# EAGLE design Rollo_APP_TS_V0.3 (EAGLE 6.4)
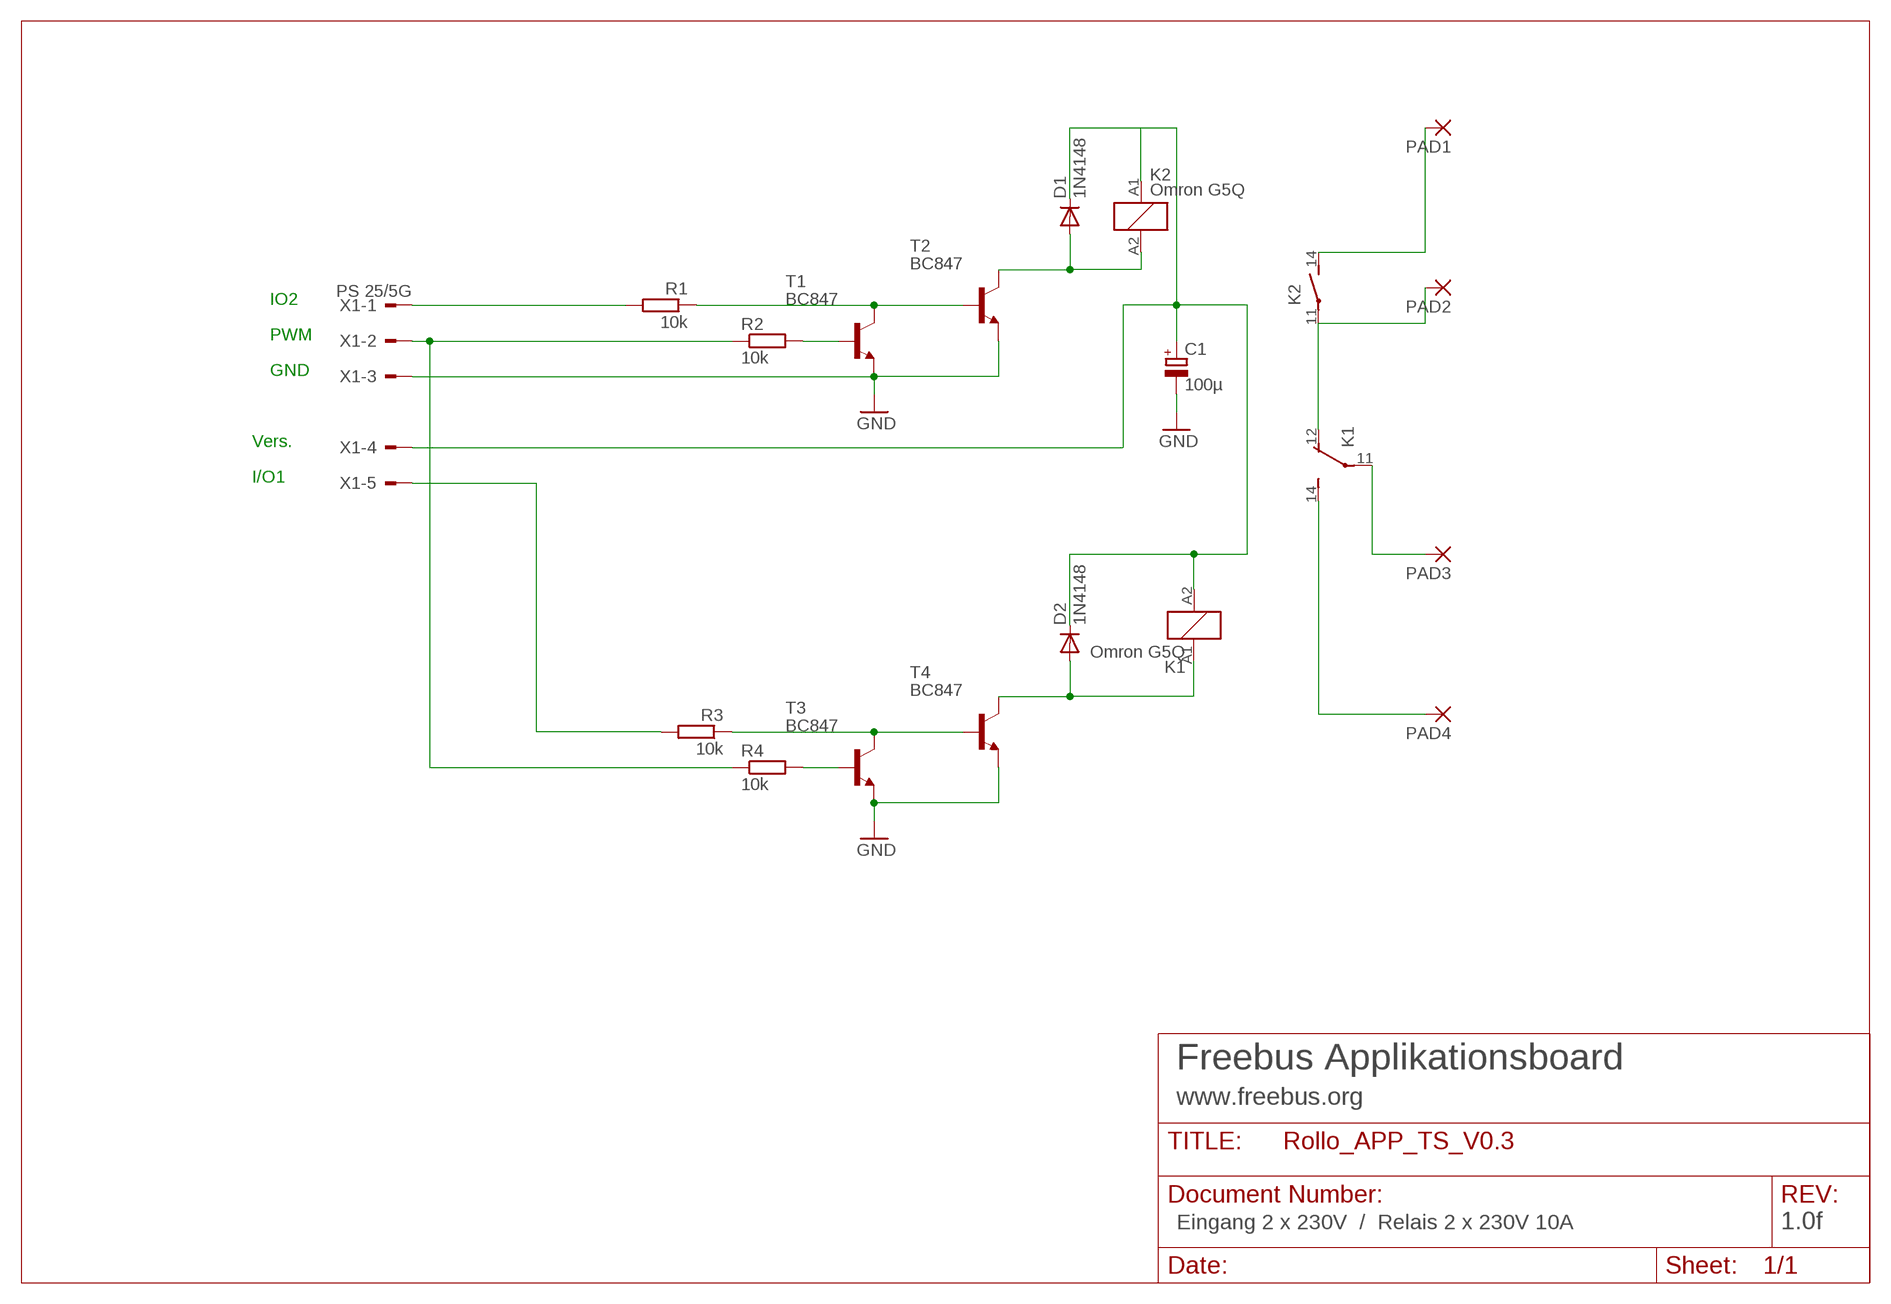
[diagram p0: schematic, sheet 1]

## Parts
C1  100µ  CPOL-EUE3.5-8  [E3,5-8]
D1  1N4148  DIODE-MINIMELF  [MINIMELF]
D2  1N4148  DIODE-MINIMELF  [MINIMELF]
K1  Omron G5Q  FREEBUS_RELAY_RE03U  [FREEBUS_RELAY_G5Q_1_EU]
K2  Omron G5Q  RE030024  [RE-SCHRACK]
PAD1  3,81/1,4  [3,81/1,4]
PAD2  3,81/1,4  [3,81/1,4]
PAD3  3,81/1,4  [3,81/1,4]
PAD4  3,81/1,4  [3,81/1,4]
R1  10k  R-EU_M1206  [M1206]
R2  10k  R-EU_M1206  [M1206]
R3  10k  R-EU_M1206  [M1206]
R4  10k  R-EU_M1206  [M1206]
T1  BC847  [SOT23]
T2  BC847  [SOT23]
T3  BC847  [SOT23]
T4  BC847  [SOT23]
X1  PS 25/5G  741256-49  [741256-49]

## Nets
GND: C1.- T1.2(E) T2.2(E) T3.2(E) T4.2(E) X1.3
N$1: K1.12(14:O) K2.11(2:P) PAD2.1(P)
N$2: R1.2 X1.1
N$3: K2.14(2:S) PAD1.1(P)
N$4: R3.2 X1.5
N$5: K1.14(14:S) PAD4.1(P)
N$6: K1.11(14:P) PAD3.1(P)
N$7: R2.1 R4.1 X1.2
N$8: R3.1 T3.3(C) T4.1(B)
N$9: R4.2 T3.1(B)
N$14: R1.1 T1.3(C) T2.1(B)
N$21: R2.2 T1.1(B)
R1: D2.A K1.A1 T4.3(C)
R3: D1.A K2.A2 T2.3(C)
VDD_IN1: C1.+ D1.C D2.C K1.A2 K2.A1 X1.4

## Notes on the sheet
- IO2
- PWM
- GND
- Vers.
- I/O1
- Freebus Applikationsboard
- www.freebus.org
- Eingang 2 x 230V  /  Relais 2 x 230V 10A | 1.0f

## Library data of the parts
C1 = rcl:CPOL-EU: POLARIZED CAPACITOR, European symbol
D1 D2 = diode:DIODE-: DIODE
K1 = hardware_application_relais8_4te_fb_relais_8_230V_83c:FREEBUS_RELAY_RE03U
K2 = relay:RE03*: Miniature PCB Relay 1 pole 6 A SCHRACK Source: http://www.schrack.com/.. 5812.pdf; MF: TYCO ELECTRONICS; MPN: RE030024; OC_FARNELL: 515851; OC_NEWARK: 52F910
PAD1-PAD4 = wirepad:3,81/1,4: THROUGH-HOLE PAD
R1-R4 = rcl:R-EU_: RESISTOR, European symbol
T1-T4 = transistor:BC847: NPN TRANSISTOR
X1 = con-conrad:741256-49: Connector with Kabel

## Board
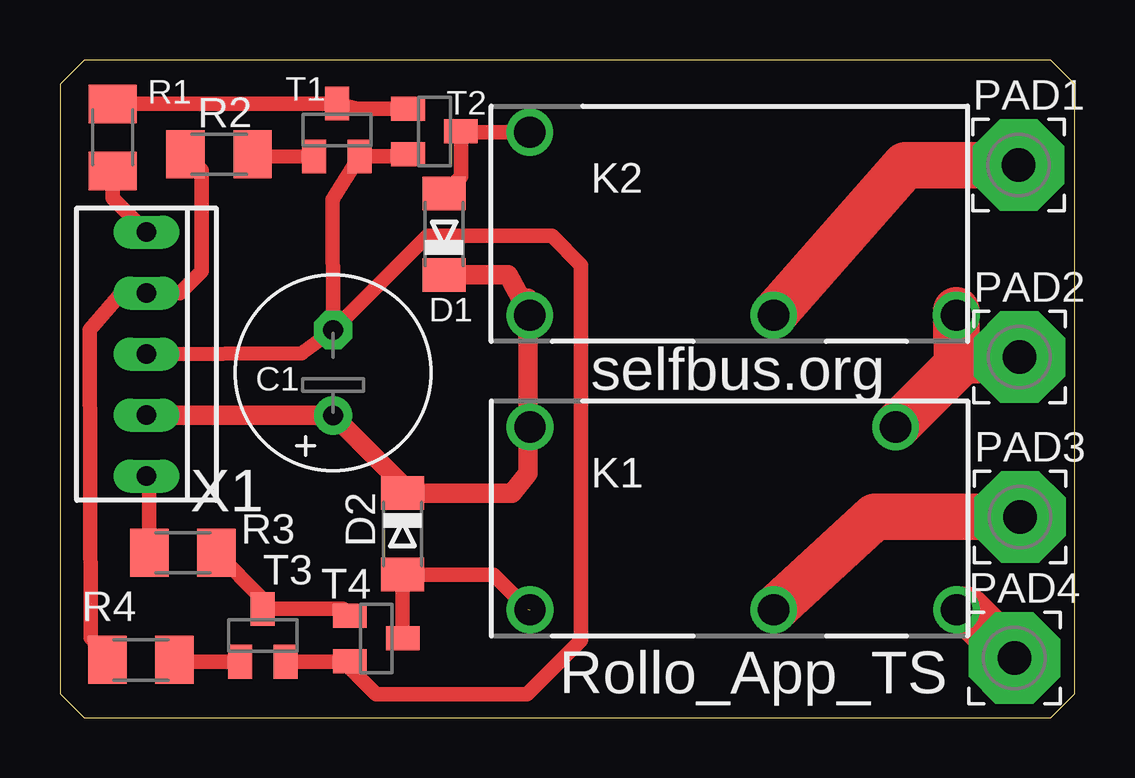
[diagram p1: board, top side]

Size 42.3 x 27.4 mm. Coordinates in mm from the lower left corner, seen from the top.
Outline: 1,0 41.3,0 42.3,1 42.3,26.4 41.3,27.4 1,27.4 0,26.4 0,1 1,0
Copper layers (1*16): Top 0.035mm / dielectric 1.5mm / Bottom 0.035mm
Design rules "default_freebus": minimum track width 10mil, minimum drill 24mil, track to track 8mil, track to pad 8mil, pad to pad 8mil, via to via 8mil, smd to smd 8mil, copper to edge 12mil, drill to drill 8mil, minimum pad ring 11mil, minimum via ring 8mil, stop-mask expansion 4mil, vias tented up to drill 0mil, thermal gap 10mil

### Footprints (pad centres in the part's own frame; a part is rotated, then mirrored left to right if it is on the bottom)
E3,5-8 = drill 0.813 pad 1.6: + -1.778,0 | drill 0.813 pad 1.6 octagon: - 1.778,0
MINIMELF = smd 1.4 x 1.8: A 1.7,0; C -1.7,0
FREEBUS_RELAY_G5Q_1_EU = drill 1.3: 11 1.27,-3.81; 12 6.35,3.81; 14 8.89,-3.81; A1 -8.89,-3.81; A2 -8.89,3.81
RE-SCHRACK = drill 1.3: 11 8.89,-3.81; 14 1.27,-3.81; A1 -8.89,-3.81; A2 -8.89,3.81
3,81/1,4 = drill 1.397 pad 3.81 octagon: 1 0,0
M1206 = smd 1.6 x 2: 1 -1.4,0; 2 1.4,0
SOT23 = smd 1 x 1.4: 1 -0.95,-1.1; 2 0.95,-1.1; 3 0,1.1
741256-49 = drill 0.813 pad 1.27 long: 1 -8.89,0; 2 -6.35,0; 3 -3.81,0; 4 -1.27,0; 5 1.27,0

### Placement (x,y rotation side)
C1  11.39,14.37 90 top
D1  16.01,20.14 90 top
D2  14.28,7.65 270 top
K1  28.48,8.3 0 top
K2  28.48,20.58 0 top
PAD1  39.96,23.02 0 top
PAD2  39.99,15.02 0 top
PAD3  40.02,8.37 0 top
PAD4  39.78,2.48 0 top
R1  2.2,24.17 270 top
R2  6.63,23.47 0 top
R3  5.13,6.87 180 top
R4  3.38,2.4 0 top
T1  11.55,24.48 0 top
T2  15.61,24.42 270 top
T3  8.46,3.43 0 top
T4  13.19,3.3 270 top
X1  3.6,11.33 270 top

### Tracks (layer width: path | path; a pad name or v marks a point on that pad's centre or on a via)
GND
  Top 0.61: T2.2 14.12,23.39 T1.2 11.36,21.59 C1.- | X1.3 10.08,15.18 C1.- | T4.2 12.07,2.33 T3.2 11.83,2.33 13.18,0.97 19.46,0.97 21.72,3.23 21.72,18.86 20.5,20.08 15.31,20.08 C1.-
N$1
  Top 1.93: K1.12 37.37,14.64 37.39,14.83 | 37.37,16.97 K2.11 37.39,14.83 | PAD2.1 37.39,14.83
N$2
  Top 0.61: R1.2 2.2,21.63 X1.1
N$3
  Top 1.93: K2.14 35.23,23.03 PAD1.1
N$4
  Top 0.61: R3.2 3.73,9.94 X1.5
N$5
  Top 1.93: K1.14 37.78,4.49 PAD4.1
N$6
  Top 1.93: K1.11 33.97,8.37 PAD3.1
N$7
  Top 0.61: R4.1 1.28,3.33 1.25,16.16 2.55,17.68 X1.2 4.99,17.68 5.9,18.6 5.9,22.81 R2.1
N$8
  Top 0.61: R3.1 8.46,4.94 T3.3 11.81,4.53 T4.1
N$9
  Top 0.61: R4.2 4.85,2.33 T3.1
N$14
  Top 0.61: R1.1 2.88,25.58 T1.3 12.39,25.38 T2.1
N$21
  Top 0.61: R2.2 8.03,23.38 T1.1
R1  (1 unrouted)
  Top 0.61: T4.3 D2.A 18.07,5.95 19.51,4.51
R3
  Top 0.61: K2.A2 16.77,24.39 T2.3 16.71,22.54 D1.A
VDD_IN1
  Top 0.406: K1.A2 19.51,12.11
  Top 0.61: 3.77,12.6 X1.4 | D2.C 14.28,9.7 | 19.51,17.47 K2.A1
  Top 0.813: 3.77,12.6 6.91,12.59 C1.+ 14.28,9.7 | D1.C 18.68,18.44 K2.A1 | D2.C 18.84,9.35 19.51,10.18 19.51,10.94 | 19.51,10.94 19.51,17.47 | 19.51,12.11 19.51,10.94

### Text on the board
tNames: selfbus.org | Rollo_App_TS
tDocu: IO2 | PWM | GND | Vers. | IO1